# Altium schematic sheet Visual_User_Interface.SchDoc: User Interface
size A4; DocumentNumber: 15; SheetNumber: 15; SheetTotal: 31
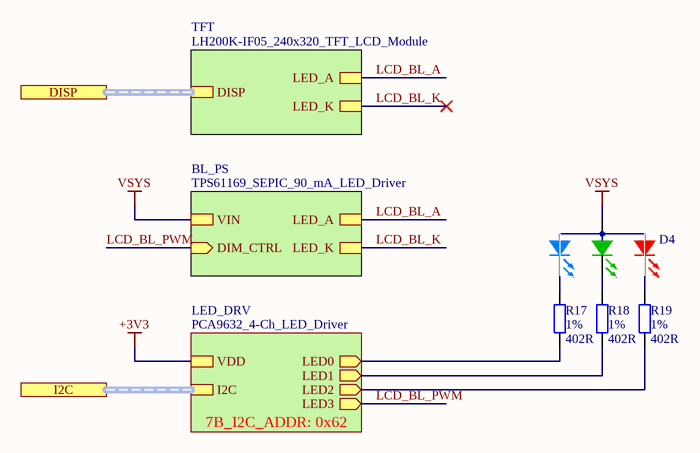
[diagram p0: Visual_User_Interface.SchDoc]

## Parts
D4  150066M153000  [LED_0606_RGB_WURTH]  (value not drawn)
R17  Tolerance: 1%  Resistance: 402R  [R_0402]  (hidden comment: RES SMD 402 OHM 1% 1/16W 0402)
R18  Tolerance: 1%  Resistance: 402R  [R_0402]  (hidden comment: RES SMD 402 OHM 1% 1/16W 0402)
R19  Tolerance: 1%  Resistance: 402R  [R_0402]  (hidden comment: RES SMD 402 OHM 1% 1/16W 0402)

## Sub-sheets
BL_PS = TPS61169_SEPIC_90_mA_LED_Driver: VIN, LED_K, DIM_CTRL (in), LED_A
LED_DRV = PCA9632_4-Ch_LED_Driver: VDD, LED0 (out), LED1 (out), LED2 (out), LED3 (out), I2C (harness I2C)  | 7B_I2C_ADDR: 0x62
TFT = LH200K-IF05_240x320_TFT_LCD_Module: DISP (harness DISP_SPI), LED_K, LED_A

## Ports
DISP (harness DISP_SPI), I2C (harness I2C)

## Nets
+3V3: sheet LED_DRV/VDD
VSYS: D4.A ; sheet BL_PS/VIN
LCD_BL_A: sheet BL_PS/LED_A, sheet TFT/LED_A
LCD_BL_K: sheet BL_PS/LED_K, sheet TFT/LED_K
LCD_BL_PWM: sheet LED_DRV/LED3, sheet BL_PS/DIM_CTRL
NetD4_BK: D4.BK R17.2
NetD4_GK: D4.GK R18.2
NetD4_RK: D4.RK R19.2
NetR17_1: R17.1 ; sheet LED_DRV/LED0
NetR18_1: R18.1 ; sheet LED_DRV/LED1
NetR19_1: R19.1 ; sheet LED_DRV/LED2

## Buses and harness runs
harness port DISP = sheet TFT/DISP
harness port I2C = sheet LED_DRV/I2C

## Notes on the sheet
- Title
- Size:
- Date:
- A4
- Number:
- Time:
- Revision:
- Sheet
- of
- File:

## Library data of the parts
D4 = LED RGB DIFFUSED SMD: Red, Green, Blue (RGB) 624nm Red, 525nm Green, 470nm Blue LED Indication - Discrete 2V Red, 3.3V Green, 3.3V Blue 0606 (1616 Metric); Manufacturer: Wurth Electronics; Color: Blue,Green,Red; Lens Style: Flat; Luminous Intensity: 180mcd; Test Current: 20mA; Viewing Angle: 120°; Element Configuration: Common Anode; Lens Size: 1.6mm; Supplier 1: Digi-Key; Manufacturer Part Number: 150066M153000; Stock 1: 7810; Pricing 1: 1=0.51, 50=0.415, 100=0.298, 500=0.272 (USD); Mount: Surface Mount; Case/Package: 0606; Case Code (Imperial): 0606; Case Code (Metric): 1616; Packaging: Tape and Reel; Lens Transparency: Diffused; Forward Voltage: 3.3V; Dominant Wavelength: 470nm; Length: 1.6mm; Height: 0.5mm; Width: 1.6mm; ComponentLink1URL: https://katalog.we-online.de/led/datasheet/150066M153000.pdf?src-supplier=Digi-Key; ComponentLink1Description: https://katalog.we-online.de/led/datasheet/150066M153000.pdf?src-supplier=Digi-Key; ComponentLink2URL: http://www.farnell.com/datasheets/2301702.pdf?src-supplier=Farnell; ComponentLink2Description: http://www.farnell.com/datasheets/2301702.pdf?src-supplier=Farnell; ComponentLink3URL: http://www.farnell.com/datasheets/2301702.pdf?src-supplier=Newark; ComponentLink3Description: http://www.farnell.com/datasheets/2301702.pdf?src-supplier=Newark; ComponentLink4URL: http://www.farnell.com/datasheets/2301702.pdf?src-supplier=Element14; ComponentLink4Description: http://www.farnell.com/datasheets/2301702.pdf?src-supplier=Element14; Supplier Part Number 1: 732-11390-1-ND
R17-R19 = RES SMD 402 OHM 1% 1/16W 0402: 402 Ohms ±1% 0.063W, 1/16W Chip Resistor 0402 (1005 Metric) Moisture Resistant Thick Film; Manufacturer: Yageo; Manufacturer Part Number: RC0402FR-07402RL; Value: 22k; Max Power Dissipation: 63mW; Temperature Coefficient: 100ppm/°C; Power Rating: 62.5mW; Voltage Rating: 50V; Supplier 1: Digi-Key; Stock 1: 0; Pricing 1: 1=0.1, 10=0.016, 100=0.0064, 1000=0.0029, 2500=0.0025, 5000=0.0021 (USD); Case/Package: 0402; Case Code (Metric): 1005; Case Code (Imperial): 0402; Min Operating Temperature: -55°C; Max Operating Temperature: 155°C; Packaging: Tape and Reel; Composition: Thick Film; Number of Terminations: 2; Features: Moisture Resistant; Length: 0.039inch; Height: 0.016inch; Width: 0.02inch; ComponentLink1URL: http://www.yageo.com/documents/recent/PYu-RC0402_51_RoHS_L_6.pdf?src-supplier=Avnet; ComponentLink1Description: http://www.yageo.com/documents/recent/PYu-RC0402_51_RoHS_L_6.pdf?src-supplier=Avnet; ComponentLink2URL: http://www.yageo.com/documents/recent/PYu-RC0402_51_RoHS_L_6.pdf?src-supplier=Avnet+Europe; ComponentLink2Description: http://www.yageo.com/documents/recent/PYu-RC0402_51_RoHS_L_6.pdf?src-supplier=Avnet+Europe; Supplier Part Number 1: YAG3152CT-ND; Contact Plating: Tin,Matte; Termination: SMD/SMT; Military Standard: Not; Depth: 0.5mm; Lead Free: Lead Free; ComponentLink3URL: http://www.mouser.com/ds/2/447/PYu-RC0402_51_RoHS_L_6_r-8721.pdf?src-supplier=Mouser; ComponentLink3Description: http://www.mouser.com/ds/2/447/PYu-RC0402_51_RoHS_L_6_r-8721.pdf?src-supplier=Mouser; Mount: Surface Mount